# Altium project IPG.PrjPcb (part 6 of 13)

## Sheet 07-PowerManagement.SchDoc: Power Management
size A2; DocumentNumber: 7; SheetNumber: 7; SheetTotal: 15
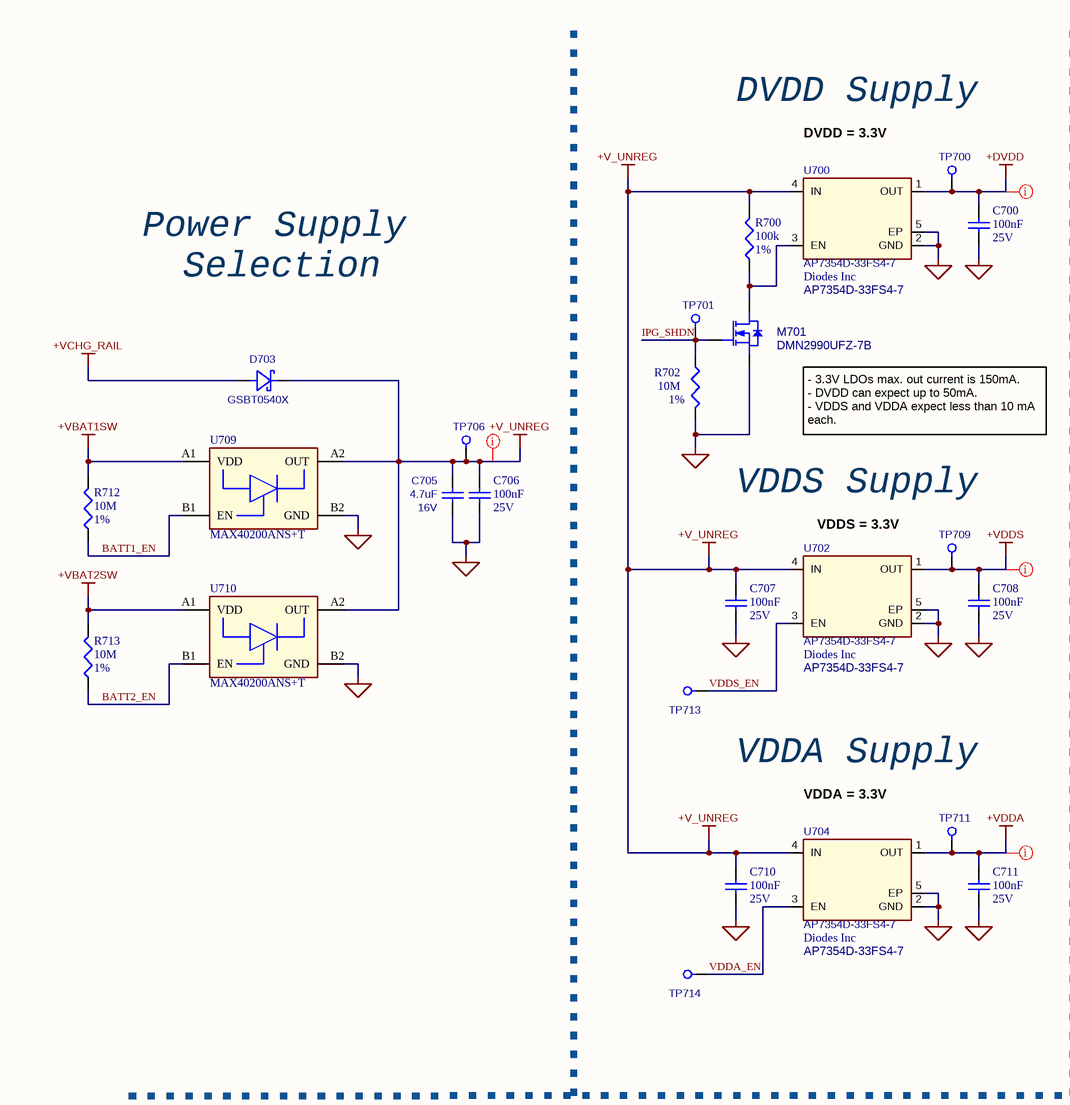
[diagram p19: 07-PowerManagement.SchDoc, left]
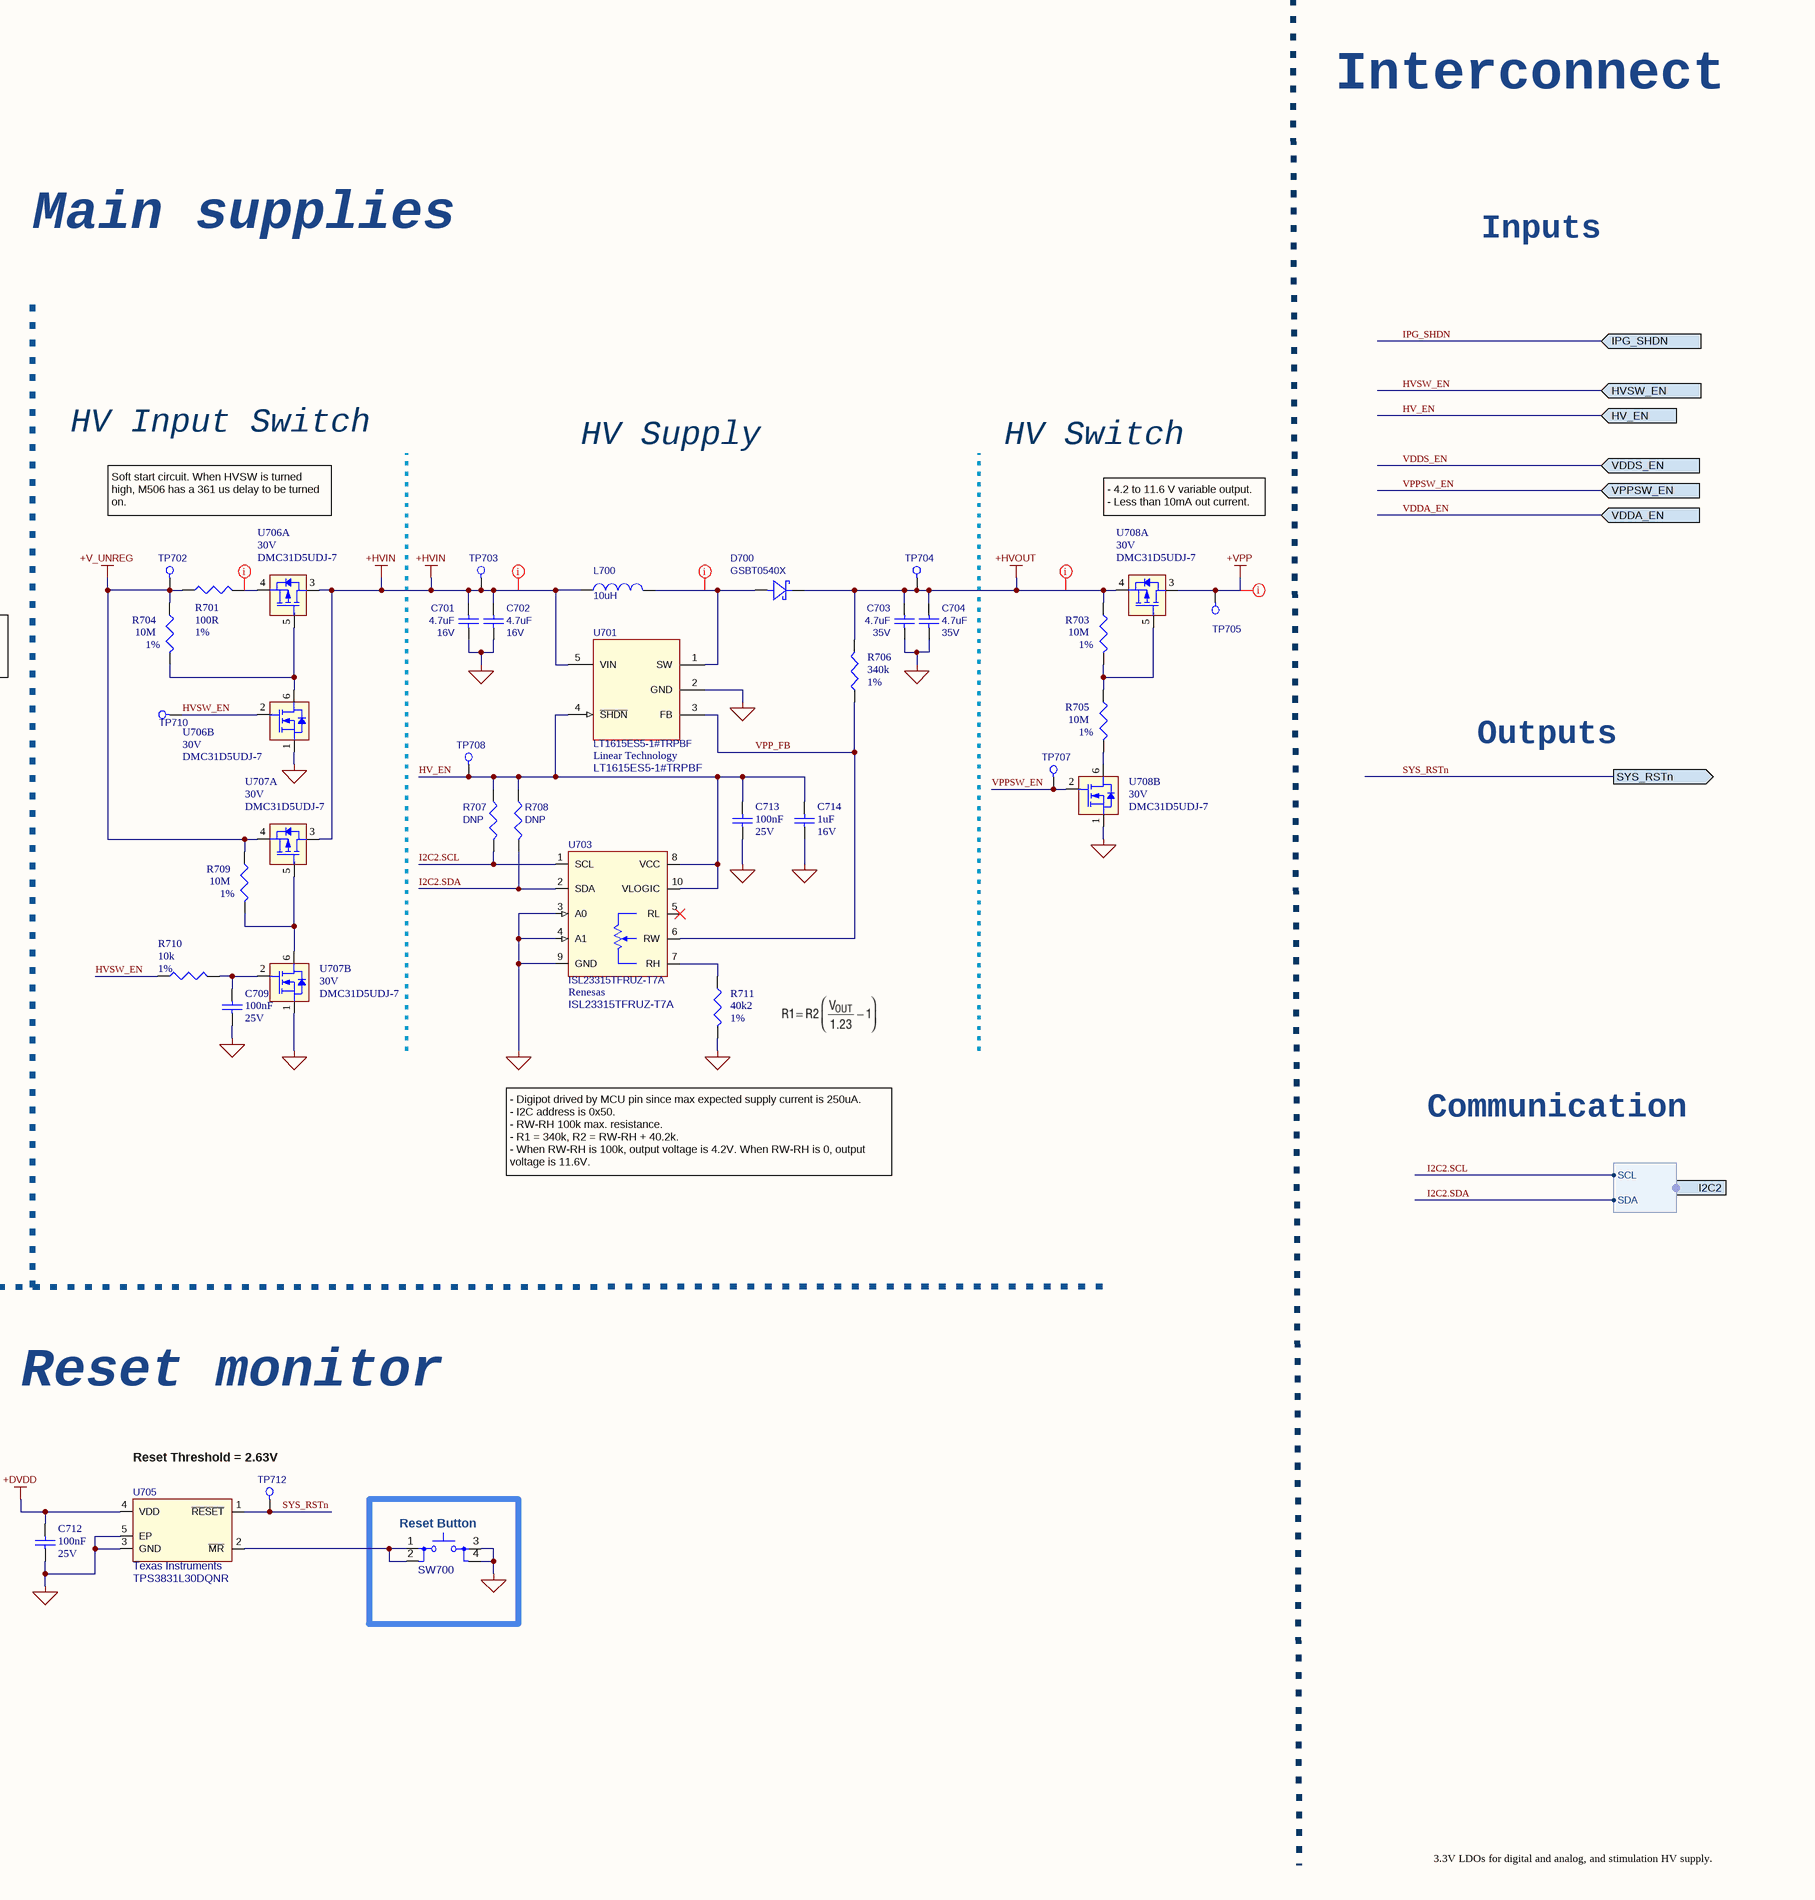
[diagram p20: 07-PowerManagement.SchDoc, right]

### Parts
C700  value 100nF  Rated DC Voltage (URdc): 25V  [C0201_C]  (hidden comment: GRM033R61E104KE14J)
C701  value 4.7uF  Rating: 16V  [CAP0603_REDUCED]  (hidden comment: GRM188R61C475KE11)
C702  value 4.7uF  Rating: 16V  [CAP0603_REDUCED]  (hidden comment: GRM188R61C475KE11)
C703  value 4.7uF  Rating: 35V  [CAP0805_REDUCED]  (hidden comment: GCM21BC7YA475KE36L)
C704  value 4.7uF  Rating: 35V  [CAP0805_REDUCED]  (hidden comment: GCM21BC7YA475KE36L)
C705  value 4.7uF  Rating: 16V  [CAP0603_REDUCED]  (hidden comment: GRM188R61C475KE11)
C706  value 100nF  Rated DC Voltage (URdc): 25V  [C0201_C]  (hidden comment: GRM033R61E104KE14J)
C707  value 100nF  Rated DC Voltage (URdc): 25V  [C0201_C]  (hidden comment: GRM033R61E104KE14J)
C708  value 100nF  Rated DC Voltage (URdc): 25V  [C0201_C]  (hidden comment: GRM033R61E104KE14J)
C709  value 100nF  Rated DC Voltage (URdc): 25V  [C0201_C]  (hidden comment: GRM033R61E104KE14J)
C710  value 100nF  Rated DC Voltage (URdc): 25V  [C0201_C]  (hidden comment: GRM033R61E104KE14J)
C711  value 100nF  Rated DC Voltage (URdc): 25V  [C0201_C]  (hidden comment: GRM033R61E104KE14J)
C712  value 100nF  Rated DC Voltage (URdc): 25V  [C0201_C]  (hidden comment: GRM033R61E104KE14J)
C713  value 100nF  Rated DC Voltage (URdc): 25V  [C0201_C]  (hidden comment: GRM033R61E104KE14J)
C714  value 1uF  Rated DC Voltage (URdc): 16V  [C0201_C]  (hidden comment: GRM033R61C105ME15D)
D700  GSBT0540X  [STM_SOD-523_R]
D703  GSBT0540X  [STM_SOD-523_R]
L700  value 10uH  [WURTH_74438323100_REDUCED]  (hidden comment: 74438323100)
M701  DMN2990UFZ-7B  [DIODESINC_X2-DFN0606-3]
R700  value 100k  Tolerance: 1%  [R0201_C]  (hidden comment: CRCW0201100KFNED)
R701  value 100R  Tolerance: 1%  [R0201_C]  (hidden comment: CRCW0201100RFNED)
R702  value 10M  Tolerance: 1%  [R0201_C]  (hidden comment: CRCW020110M0FNED)
R703  value 10M  Tolerance: 1%  [R0201_C]  (hidden comment: CRCW020110M0FNED)
R704  value 10M  Tolerance: 1%  [R0201_C]  (hidden comment: CRCW020110M0FNED)
R705  value 10M  Tolerance: 1%  [R0201_C]  (hidden comment: CRCW020110M0FNED)
R706  value 340k  Tolerance: 1%  [R0201_C]  (hidden comment: CRCW0201340KFKED)
R707  value DNP  [RES0402_REDUCED]  (hidden comment: Resistor, DNP, 0402)
R708  value DNP  [RES0402_REDUCED]  (hidden comment: Resistor, DNP, 0402)
R709  value 10M  Tolerance: 1%  [R0201_C]  (hidden comment: CRCW020110M0FNED)
R710  value 10k  Tolerance: 1%  [R0201_C]  (hidden comment: CRCW020110K0FNED)
R711  value 40k2  Tolerance: 1%  [R0201_C]  (hidden comment: CRCW020140K2FNED)
R712  value 10M  Tolerance: 1%  [R0201_C]  (hidden comment: CRCW020110M0FNED)
R713  value 10M  Tolerance: 1%  [R0201_C]  (hidden comment: CRCW020110M0FNED)
SW700  PTS647SN50SMTR2LFS  [CK_PTS647]  (value not drawn)
TP700  Test Point  [testpad_0.9mm]  (value not drawn)  (no BOM)
TP701  Test Point  [testpad_0.9mm]  (value not drawn)  (no BOM)
TP702  Test Point  [testpad_0.9mm]  (value not drawn)  (no BOM)
TP703  Test Point  [testpad_0.9mm]  (value not drawn)  (no BOM)
TP704  Test Point  [testpad_0.9mm]  (value not drawn)  (no BOM)
TP705  Test Point  [testpad_0.9mm]  (value not drawn)  (no BOM)
TP706  Test Point  [testpad_0.9mm]  (value not drawn)  (no BOM)
TP707  Test Point  [testpad_0.9mm]  (value not drawn)  (no BOM)
TP708  Test Point  [testpad_0.9mm]  (value not drawn)  (no BOM)
TP709  Test Point  [testpad_0.9mm]  (value not drawn)  (no BOM)
TP710  Test Point  [testpad_0.9mm]  (value not drawn)  (no BOM)
TP711  Test Point  [testpad_0.9mm]  (value not drawn)  (no BOM)
TP712  Test Point  [testpad_0.9mm]  (value not drawn)  (no BOM)
TP713  Test Point  [testpad_0.9mm]  (value not drawn)  (no BOM)
TP714  Test Point  [testpad_0.9mm]  (value not drawn)  (no BOM)
U700  AP7354D-33FS4-7  Manufacturer: Diodes Inc  [X2-DFN1010-4 (Type B)]
U701  LT1615ES5-1#TRPBF  Manufacturer: Linear Technology  [LT_S5_L]
U702  AP7354D-33FS4-7  Manufacturer: Diodes Inc  [X2-DFN1010-4 (Type B)]
U703  ISL23315TFRUZ-T7A  Manufacturer: Renesas  [RENESAS_L10.2.1X1.6A_UTQFN10]
U704  AP7354D-33FS4-7  Manufacturer: Diodes Inc  [X2-DFN1010-4 (Type B)]
U705  Manufacturer: Texas Instruments  [TI_X2SON_DQN0004A]  (hidden comment: TPS3831L30DQNR)
U706  DMC31D5UDJ-7  Vds(Max): 30V  [DIODESINC_SOT-963-6]  (parts A,B of 2)
U707  DMC31D5UDJ-7  Vds(Max): 30V  [DIODESINC_SOT-963-6]  (parts A,B of 2)
U708  DMC31D5UDJ-7  Vds(Max): 30V  [DIODESINC_SOT-963-6]  (parts A,B of 2)
U709  MAX40200ANS+T  [BGA4N35P2X2_72X72X50N]
U710  MAX40200ANS+T  [BGA4N35P2X2_72X72X50N]

### Ports
HV_EN (in), HVSW_EN (in), I2C2 (harness I2C), IPG_SHDN (in), SYS_RSTn (out), VDDA_EN (in), VDDS_EN (in), VPPSW_EN (in)

### Harnesses
I2C: SDA, SCL

### Nets
+DVDD: C700.2 C712.2 TP700.1 U700.1(OUT) U705.4(VDD)
+HVIN: C701.1 C702.1 L700.1 TP703.1 U701.5(VIN) U706.3 U707.3
+HVOUT: C703.1 C704.1 D700.1 R703.1 R706.2 TP704.1 U708.4
+V_UNREG: C705.1 C706.2 C707.2 C710.2 D703.1 R700.2 R701.1 R704.1 R709.1 TP702.1 TP706.1 U700.4(IN) U702.4(IN) U704.4(IN) U707.4 U709.A2(OUT) U710.A2(OUT)
+VBAT1SW: R712.2 U709.A1(VDD)
+VBAT2SW: R713.2 U710.A1(VDD)
+VCHG_RAIL: D703.2
+VDDA: C711.2 TP711.1 U704.1(OUT)
+VDDS: C708.2 TP709.1 U702.1(OUT)
+VPP: TP705.1 U708.3
GND: C700.1 C701.2 C702.2 C703.2 C704.2 C705.2 C706.1 C707.1 C708.1 C709.1 C710.1 C711.1 C712.1 C713.1 C714.1 M701.2(S) R702.2 R711.2 SW700.3 SW700.4 U700.2(GND) U700.5(EP) U701.2(GND) U702.2(GND) U702.5(EP) U703.3(A0) U703.4(A1) U703.9(GND) U704.2(GND) U704.5(EP) U705.3(GND) U705.5(EP) U706.1 U707.1 U708.1 U709.B2(GND) U710.B2(GND)
BATT1_EN: R712.1 U709.B1(EN)
BATT2_EN: R713.1 U710.B1(EN)
HV_EN: C713.2 C714.2 R707.1 R708.1 TP708.1 U701.4(~{SHDN}) U703.8(VCC) U703.10(VLOGIC) ; port HV_EN
HVSW_EN: R710.1 TP710.1 U706.2 ; port HVSW_EN
I2C2.SCL: R707.2 U703.1(SCL) ; port I2C2.SCL
I2C2.SDA: R708.2 U703.2(SDA) ; port I2C2.SDA
IPG_SHDN: M701.1(G) R702.1 TP701.1 ; port IPG_SHDN
SYS_RSTn: TP712.1 U705.1(~{RESET}) ; port SYS_RSTn
VDDA_EN: TP714.1 U704.3(EN) ; port VDDA_EN
VDDS_EN: TP713.1 U702.3(EN) ; port VDDS_EN
VPP_FB: R706.1 U701.3(FB) U703.6(RW)
VPPSW_EN: TP707.1 U708.2 ; port VPPSW_EN
NetC709_2: C709.2 R710.2 U707.2
NetD700_2: D700.2 L700.2 U701.1(SW)
NetM701_3: M701.3(D) R700.1 U700.3(EN)
NetR701_2: R701.2 U706.4
NetR703_2: R703.2 R705.1 U708.5
NetR704_2: R704.2 U706.5 U706.6
NetR705_2: R705.2 U708.6
NetR709_2: R709.2 U707.5 U707.6
NetR711_1: R711.1 U703.7(RH)
NetSW700_1: SW700.1 SW700.2 U705.2(~{MR})

Not connected (* = marked no-connect by the designer): U703 5(RL)*

### Layout directives
rule Supply Nets [Voltage = 3.300]; net class POWER: +DVDD, +VDDA, +VDDS
Voltage: 4.2-11.6V; net class POWER: +VPP
net class POWER; Voltage: 2.8-5.0V; net class DCDC_LOOP: +HVIN
net class POWER; Voltage: 4.2-11.6V: +HVOUT
net class POWER; Voltage: 2.8-5.0V: +V_UNREG, NetR701_2
net class POWER; Voltage: 4.2-11.6V; net class DCDC_LOOP: NetD700_2

### Notes on the sheet
- Interconnect
- Main supplies
- Inputs
- DVDD Supply
- DVDD = 3.3V
- HV Input Switch
- Power Supply
- HV Supply
- HV Switch
- Selection
- Soft start circuit. When HVSW is turned high, M506 has a 361 us delay to be turned on.
- - 4.2 to 11.6 V variable output.
  - Less than 10mA out current.
- - 3.3V LDOs max. out current is 150mA.
  - DVDD can expect up to 50mA.
  - VDDS and VDDA expect less than 10 mA each.
- VDDS Supply
- Outputs
- VDDS = 3.3V
- VDDA Supply
- VDDA = 3.3V
- Communication
- - Digipot drived by MCU pin since max expected supply current is 250uA.
  - I2C address is 0x50.
  - RW-RH 100k max. resistance.
  - R1 = 340k, R2 = RW-RH + 40.2k.
  - When RW-RH is 100k, output voltage is 4.2V. When RW-RH is 0, output voltage is 11.6V.
- Reset monitor
- Reset Threshold = 2.63V
- (near SW700) Reset Button
- 3.3V LDOs for digital and analog, and stimulation HV supply.
- Project:
- Schematic:
- Design by:
- Date:
- Ver:
- .
- Comments:
- Reviewed by:

### Library data of the parts
C700 C706-C713 = GRM033R61E104KE14J: as C900-C906 on sheet 09-IMC; Category: Ceramic Capacitors; Supplier: Digikey; Supplier Part Number: 490-14571-1-ND; Manufacturer Part Number: GRM033R61E104KE14J; RoHS: Yes; Stock: 1540851; Pricing: 1=0,1, 10=0,033, 50=0,0192, 100=0,0148, 500=0,01118, 1000=0,00878, 2500=0,00798, 5000=0,00734 (USD); Mounting Technology: Surface Mount; Pins: 2; Dielectric Material: Ceramic; Package Shape: Rectangular; Case/Package: 0201; Terminal Finish: Nickel; Min Operating Temperature: -55°C; Max Operating Temperature: 85°C; JESD-609 Code: e3; Capacitor Type: Ceramic; Tolerance  (fill in as +-): 10%; Package Style: SMTMeter; Packaging: Tape and Reel; Tolerance (fill in as +-): 10%; Temperature Characteristics Code: X5R; Termination: Wraparound; Length: 0.6mm; Width: 0.3mm; Height: 0.3mm; Reach SVHC Compliant: Yes; RoHS Compliant: Yes; ComponentLink1URL: https://psearch.en.murata.com:443/capacitor/product/GRM033R61E104KE14%23.pdf?src-supplier=IHS+Markit; ComponentLink1Description: https://psearch.en.murata.com:443/capacitor/product/GRM033R61E104KE14%23.pdf?src-supplier=IHS+Markit; ComponentLink2URL: http://www.mouser.com/ds/2/281/c02e-2905.pdf?src-supplier=Mouser; ComponentLink2Description: http://www.mouser.com/ds/2/281/c02e-2905.pdf?src-supplier=Mouser; ComponentLink3URL: http://search.murata.co.jp/Ceramy/image/img/A01X/G101/ENG/GRM033R61E104KE14-01.pdf?src-supplier=Digikey; ComponentLink3Description: http://search.murata.co.jp/Ceramy/image/img/A01X/G101/ENG/GRM033R61E104KE14-01.pdf?src-supplier=Digikey; ComponentLink4URL: https://search.murata.co.jp/Ceramy/image/img/A01X/G101/ENG/GRM033R61E104KE14-01.pdf?src-supplier=Digikey; ComponentLink4Description: https://search.murata.co.jp/Ceramy/image/img/A01X/G101/ENG/GRM033R61E104KE14-01.pdf?src-supplier=Digikey; Supplier 1: Arrow Electronics; Supplier Part Number 1: GRM033R61E104KE14J
C701 C702 C705 = GRM188R61C475KE11: as C302 on sheet 03-MCU; Length (mm): 1.60 ±0.10; Medical Grade MFR: Murata; PCB Footprint: cap0603_reduced; Thickness (mm): 0.80 ±0.10; Width (mm): 0.80 ±0.10; Category: Capacitor; Package Description: 0603; Check: *; Supplier 1: Arrow Electronics; Supplier Part Number 1: GRM188R61C475KE11D; Status: *; Review: *; Manufacturer Part Number: GRM188R61C475KE11
C703 C704 = GCM21BC7YA475KE36L: Capacitor, 4.7uF, X7S, 35V, 10%, 0805, Implant-grade; Manufacturer: Murata; Medical Grade MFR PN: GCH21BC7YA475KE11; Review: 020823; Length (mm): 2.00 ±0.20; Medical Grade MFR: Murata; PCB Footprint: cap0805_reduced; Thickness (mm): 1.25 ±0.20; Width (mm): 1.25 ±0.20; Category: Capacitor; Package Description: 0805; Check: *; Supplier 1: Arrow Electronics; Supplier Part Number 1: GCM21BC7YA475KE36L; Status: Approved; Manufacturer Part Number: GCM21BC7YA475KE36L
C714 = GRM033R61C105ME15D: as C317 on sheet 03-MCU; Supplier: Digikey; Supplier Part Number: 490-18654-1-ND; Manufacturer Part Number: GRM033R61C105ME15D; RoHS: No; Category: Ceramic Capacitors; Stock: 132893; Pricing: 1=0,16, 10=0,105, 50=0,0628, 100=0,0493, 500=0,03644, 1000=0,03017, 2500=0,02808, 5000=0,02569 (USD); Supplier 1: Avnet; Supplier Part Number 1: GRM033R61C105ME15D
D700 D703 = GSBT0540X: DIODE SCHOTTKY 40V 500MA SOD523; Manufacturer: Good-Ark Semiconductor; Medical Grade MFR: TBD; Rating: 40V, 500mA; Medical Grade MFR PN: TBD; PCB Footprint: TBD; Category: Diode; Package Description: SOD-523; Supplier 1: Digikey; Supplier Part Number 1: 4786-GSBT0540XCT-ND; Manufacturer Part Number: GSBT0540X
L700 = 74438323100: Inductor, 10uH, 600mA, 20%, 1008; Manufacturer: Wurth; Medical Grade MFR: TBD; Review: 020823; Length (mm): 2.50 ±0.20; Medical Grade MFR PN: TBD; PCB Footprint: TBD; Rating: 600mA; Thickness (mm): 1.00; Width (mm): 2.00 ±0.20; Category: Inductor; Supplier 1: Rs; Supplier Part Number 1: 7922736P; Status: Approved; Manufacturer Part Number: 74438323100
M701 = DMN2990UFZ-7B: MOSFET, N-Chan, 20V, 170mA, DFN0606; Manufacturer: Diodes Inc; Medical Grade MFR: TBD; Review: 020823; Category: Transistor; Length (mm): 0.62 ±0.05; Medical Grade MFR PN: TBD; PCB Footprint: TBD; Rating: 20V; Thickness (mm): 0.38 ±0.02; Value: DMN2990UFZ-7B; Width (mm): 0.62 ±0.05; Supplier 1: Digi-Key; Supplier Part Number 1: DMN2990UFZ-7BDICT-ND; Status: Approved; Manufacturer Part Number: DMN2990UFZ-7B
R700 = CRCW0201100KFNED: as R914 on sheet 09-IMC; Category: Chip SMD Resistors; Supplier: Digikey; Supplier Part Number: 541-100KABCT-ND; Manufacturer Part Number: CRCW0201100KFNED; RoHS: Yes; Stock: 8252; Pricing: 1=0,1, 10=0,037, 50=0,0242, 100=0,0204, 500=0,01426, 1000=0,01241, 5000=0,00924 (USD); Mounting Technology: Surface Mount; Pins: 2; Package Shape: Rectangular; Case/Package: 0201; Terminal Finish: Nickel; Min Operating Temperature: -55°C; Max Operating Temperature: 155°C; JESD-609 Code: e3; Resistor Type: FIXED RESISTOR; Construction: Chip; Package Style: SMTMeter; Packaging: Tape and Reel; Technology: METAL GLAZE/THICK FILM; Termination: Wraparound; Working Voltage: 30V; Reach SVHC Compliant: Yes; RoHS Compliant: Yes; ComponentLink1URL: https://datasheet.ciiva.com:443/pdfs/VipMasterIC/IC/VISH/VISH-S-A0002932828/VISH-S-A0002932828-1.pdf?src-supplier=IHS+Markit; ComponentLink1Description: https://datasheet.ciiva.com:443/pdfs/VipMasterIC/IC/VISH/VISH-S-A0002932828/VISH-S-A0002932828-1.pdf?src-supplier=IHS+Markit; ComponentLink2URL: https://datasheet.ciiva.com/2474/crcw0201e3-2474797.pdf?src-supplier=Digikey; ComponentLink2Description: https://datasheet.ciiva.com/2474/crcw0201e3-2474797.pdf?src-supplier=Digikey; ComponentLink3URL: https://datasheet.ciiva.com/2474/crcw0201e3-2474798.pdf?src-supplier=Digikey; ComponentLink3Description: https://datasheet.ciiva.com/2474/crcw0201e3-2474798.pdf?src-supplier=Digikey; ComponentLink4URL: https://datasheet.ciiva.com/2474/crcw0201e3-2474799.pdf?src-supplier=Digikey; ComponentLink4Description: https://datasheet.ciiva.com/2474/crcw0201e3-2474799.pdf?src-supplier=Digikey; ComponentLink5URL: https://datasheet.ciiva.com/16436/dcrcwe3-16436220.pdf?src-supplier=Future+Electronics; ComponentLink5Description: https://datasheet.ciiva.com/16436/dcrcwe3-16436220.pdf?src-supplier=Future+Electronics; ComponentLink6URL: https://datasheet.ciiva.com/28634/1847332-28634462.pdf?src-supplier=Element14; ComponentLink6Description: https://datasheet.ciiva.com/28634/1847332-28634462.pdf?src-supplier=Element14; ComponentLink7URL: https://datasheet.ciiva.com/22665/1700795-22665689.pdf?src-supplier=Element14; ComponentLink7Description: https://datasheet.ciiva.com/22665/1700795-22665689.pdf?src-supplier=Element14; ComponentLink8URL: https://datasheet.ciiva.com/22870/70202042-22870476.pdf?src-supplier=Allied+Electronics; ComponentLink8Description: https://datasheet.ciiva.com/22870/70202042-22870476.pdf?src-supplier=Allied+Electronics; ComponentLink9URL: https://datasheet.ciiva.com/16777/70202042-16777655.pdf?src-supplier=Allied+Electronics; ComponentLink9Description: https://datasheet.ciiva.com/16777/70202042-16777655.pdf?src-supplier=Allied+Electronics; Supplier 1: Digikey; Supplier Part Number 1: 541-100KABCT-ND
R701 = CRCW0201100RFNED: Fixed Resistor, Metal Glaze/thick Film, 0.05W, 100ohm, 30V, 1% +/-Tol, 200ppm/Cel, Surface Mount, 0201; Manufacturer: Vishay; Medical Grade MFR: Mini-Systems; Medical Grade MFR PN: MWA96SM-1000F-NS62TR; Power: 50mW; Rated Temperature: 70°C; Temperature Coefficient: 200ppm/°C; Package Height: 0.23mm; Package Length: 0.6mm; Package Width: 0.3mm; Reference Standard: AEC-Q200; Category: Chip SMD Resistors; Supplier: Digikey; Supplier Part Number: 541-100ABCT-ND; Manufacturer Part Number: CRCW0201100RFNED; RoHS: Yes; Stock: 52904; Pricing: 1=0,1, 10=0,037, 50=0,0242, 100=0,0204, 500=0,01426, 1000=0,01241, 5000=0,00924 (USD); Mounting Technology: Surface Mount; Pins: 2; Package Shape: Rectangular; Terminal Finish: Nickel; Case/Package: 0201; Min Operating Temperature: -55°C; Max Operating Temperature: 155°C; JESD-609 Code: e3; Package Style: SMTMeter; Technology: METAL GLAZE/THICK FILM; Resistor Type: FIXED RESISTOR; Construction: Chip; Packaging: Tape and Reel; Termination: Wraparound; Working Voltage: 30V; Reach SVHC Compliant: Yes; RoHS Compliant: Yes; ComponentLink1URL: https://datasheet.ciiva.com:443/pdfs/VipMasterIC/IC/VISH/VISH-S-A0002932828/VISH-S-A0002932828-1.pdf?src-supplier=IHS+Markit; ComponentLink1Description: https://datasheet.ciiva.com:443/pdfs/VipMasterIC/IC/VISH/VISH-S-A0002932828/VISH-S-A0002932828-1.pdf?src-supplier=IHS+Markit; ComponentLink2URL: https://datasheet.ciiva.com/8083/crcw0201e3-8083961.pdf?src-supplier=Avnet; ComponentLink2Description: https://datasheet.ciiva.com/8083/crcw0201e3-8083961.pdf?src-supplier=Avnet; ComponentLink3URL: https://datasheet.ciiva.com/2527/crcw0201e3-2527593.pdf?src-supplier=Digikey; ComponentLink3Description: https://datasheet.ciiva.com/2527/crcw0201e3-2527593.pdf?src-supplier=Digikey; ComponentLink4URL: https://datasheet.ciiva.com/2527/crcw0201e3-2527591.pdf?src-supplier=Digikey; ComponentLink4Description: https://datasheet.ciiva.com/2527/crcw0201e3-2527591.pdf?src-supplier=Digikey; ComponentLink5URL: https://datasheet.ciiva.com/2527/crcw0201e3-2527592.pdf?src-supplier=Digikey; ComponentLink5Description: https://datasheet.ciiva.com/2527/crcw0201e3-2527592.pdf?src-supplier=Digikey; ComponentLink6URL: https://datasheet.ciiva.com/7983/1719906-7983317.pdf?src-supplier=Element14; ComponentLink6Description: https://datasheet.ciiva.com/7983/1719906-7983317.pdf?src-supplier=Element14; ComponentLink7URL: https://datasheet.ciiva.com/7983/1719906-7983318.pdf?src-supplier=Element14; ComponentLink7Description: https://datasheet.ciiva.com/7983/1719906-7983318.pdf?src-supplier=Element14; ComponentLink8URL: https://datasheet.ciiva.com/16757/70202042-16757607.pdf?src-supplier=Allied+Electronics; ComponentLink8Description: https://datasheet.ciiva.com/16757/70202042-16757607.pdf?src-supplier=Allied+Electronics; ComponentLink9URL: https://datasheet.ciiva.com/16202/dcrcwe3-16202605.pdf?src-supplier=Future+Electronics; ComponentLink9Description: https://datasheet.ciiva.com/16202/dcrcwe3-16202605.pdf?src-supplier=Future+Electronics; ComponentLink10URL: https://datasheet.ciiva.com/22665/1700795-22665690.pdf?src-supplier=Element14; ComponentLink10Description: https://datasheet.ciiva.com/22665/1700795-22665690.pdf?src-supplier=Element14; Supplier 1: Digikey; Supplier Part Number 1: 541-100ABCT-ND
R702-R705 R709 R712 R713 = CRCW020110M0FNED: as R903 on sheet 09-IMC; Category: Chip SMD Resistors; Supplier: Mouser; Supplier Part Number: 71-CRCW020110M0FNED; Manufacturer Part Number: CRCW020110M0FNED; RoHS: Yes; Stock: 159754; Pricing: 1=0,1, 10=0,024, 50=0,024, 100=0,014, 1000=0,011, 10000=0,006 (USD); Mounting Technology: Surface Mount; Pins: 2; Package Shape: Rectangular; Case/Package: 0201; Terminal Finish: Nickel; Min Operating Temperature: -55°C; Max Operating Temperature: 155°C; JESD-609 Code: e3; Resistor Type: FIXED RESISTOR; Packaging: Tape and Reel; Technology: METAL GLAZE/THICK FILM; Termination: Wraparound; Working Voltage: 30V; Reach SVHC Compliant: Yes; RoHS Compliant: Yes; ComponentLink1URL: https://datasheet.ciiva.com:443/pdfs/VipMasterIC/IC/VISH/VISH-S-A0002932828/VISH-S-A0002932828-1.pdf?src-supplier=IHS+Markit; ComponentLink1Description: https://datasheet.ciiva.com:443/pdfs/VipMasterIC/IC/VISH/VISH-S-A0002932828/VISH-S-A0002932828-1.pdf?src-supplier=IHS+Markit; ComponentLink2URL: https://datasheet.ciiva.com/7673/1719906-7673177.pdf?src-supplier=Element14; ComponentLink2Description: https://datasheet.ciiva.com/7673/1719906-7673177.pdf?src-supplier=Element14; ComponentLink3URL: https://datasheet.ciiva.com/7673/1719906-7673178.pdf?src-supplier=Element14; ComponentLink3Description: https://datasheet.ciiva.com/7673/1719906-7673178.pdf?src-supplier=Element14; ComponentLink4URL: https://datasheet.ciiva.com/22692/1719906-22692711.pdf?src-supplier=Element14; ComponentLink4Description: https://datasheet.ciiva.com/22692/1719906-22692711.pdf?src-supplier=Element14; ComponentLink5URL: https://datasheet.ciiva.com/22665/1700795-22665701.pdf?src-supplier=Element14; ComponentLink5Description: https://datasheet.ciiva.com/22665/1700795-22665701.pdf?src-supplier=Element14; Supplier 1: Digikey; Supplier Part Number 1: 541-CRCW020110M0FNEDCT-ND
R706 = CRCW0201340KFKED: Fixed Resistor, Metal Glaze/thick Film, 0.05W, 340000ohm, 30V, 1% +/-Tol, 200ppm/Cel, Surface Mount, 0201; Manufacturer: Vishay; Medical Grade MFR: Mini-Systems; Medical Grade MFR PN: MWA96SM-3403F-NS62TR; Power: 50mW; Rated Temperature: 70°C; Temperature Coefficient: 200ppm/°C; Package Height: 0.23mm; Package Length: 0.6mm; Package Width: 0.3mm; Reference Standard: AEC-Q200; Supplier: Digikey; Supplier Part Number: 541-340KAABDKR-ND; Manufacturer Part Number: CRCW0201340KFKED; RoHS: Yes; Category: Chip SMD Resistors; Pricing: 1=0,1, 10=0,037, 50=0,0242, 100=0,0204, 500=0,01426, 1000=0,01241, 5000=0,00924 (USD); Mounting Technology: Surface Mount; Pins: 2; Package Shape: Rectangular; Case/Package: 0201; Terminal Finish: Nickel; Min Operating Temperature: -55°C; Max Operating Temperature: 155°C; JESD-609 Code: e3; Resistor Type: FIXED RESISTOR; Construction: Chip; Package Style: SMTMeter; Packaging: Tape and Reel; Technology: METAL GLAZE/THICK FILM; Termination: Wraparound; Working Voltage: 30V; Reach SVHC Compliant: Yes; RoHS Compliant: Yes; ComponentLink1URL: https://datasheet.ciiva.com:443/pdfs/VipMasterIC/IC/VISH/VISH-S-A0002932828/VISH-S-A0002932828-1.pdf?src-supplier=IHS+Markit; ComponentLink1Description: https://datasheet.ciiva.com:443/pdfs/VipMasterIC/IC/VISH/VISH-S-A0002932828/VISH-S-A0002932828-1.pdf?src-supplier=IHS+Markit; ComponentLink2URL: https://datasheet.ciiva.com/2577/crcw0201e3-2577344.pdf?src-supplier=Digikey; ComponentLink2Description: https://datasheet.ciiva.com/2577/crcw0201e3-2577344.pdf?src-supplier=Digikey; ComponentLink3URL: https://datasheet.ciiva.com/8944/crcw0201e3-8944076.pdf?src-supplier=Avnet; ComponentLink3Description: https://datasheet.ciiva.com/8944/crcw0201e3-8944076.pdf?src-supplier=Avnet; ComponentLink4URL: https://datasheet.ciiva.com/7673/1719906-7673960.pdf?src-supplier=Element14; ComponentLink4Description: https://datasheet.ciiva.com/7673/1719906-7673960.pdf?src-supplier=Element14; ComponentLink5URL: https://datasheet.ciiva.com/7673/1719906-7673961.pdf?src-supplier=Element14; ComponentLink5Description: https://datasheet.ciiva.com/7673/1719906-7673961.pdf?src-supplier=Element14; ComponentLink6URL: https://datasheet.ciiva.com/22706/1719906-22706187.pdf?src-supplier=Element14; ComponentLink6Description: https://datasheet.ciiva.com/22706/1719906-22706187.pdf?src-supplier=Element14; ComponentLink7URL: https://datasheet.ciiva.com/22675/1700795-22675861.pdf?src-supplier=Element14; ComponentLink7Description: https://datasheet.ciiva.com/22675/1700795-22675861.pdf?src-supplier=Element14; Supplier 1: Digikey; Supplier Part Number 1: 541-340KAABCT-ND
R707 R708 = RES_DNP_0402: Review: 020823; Length (mm): 1.12 ±0.10; Manufacturer: N/A; Manufacturer PN: N/A; Medical Grade MFR: N/A; Medical Grade MFR PN: N/A; PCB Footprint: res0402_reduced; Rating: N/A; Thickness (mm): 0.33 ±0.08; Width (mm): 0.56 ±0.08; Category: Resistor; Status: Approved
R710 = CRCW020110K0FNED: as R300 on sheet 03-MCU; Category: Chip SMD Resistors; Supplier: Digikey; Supplier Part Number: 541-10.0KABCT-ND; Manufacturer Part Number: CRCW020110K0FNED; RoHS: Yes; Stock: 1011530; Pricing: 1=0,1, 10=0,037, 50=0,0242, 100=0,0204, 500=0,01426, 1000=0,01241, 5000=0,00924 (USD); Mounting Technology: Surface Mount; Pins: 2; Package Shape: Rectangular; Case/Package: 0201; Terminal Finish: Nickel; Min Operating Temperature: -55°C; Max Operating Temperature: 155°C; JESD-609 Code: e3; Resistor Type: FIXED RESISTOR; Construction: Chip; Package Style: SMTMeter; Packaging: Tape and Reel; Technology: METAL GLAZE/THICK FILM; Termination: Wraparound; Working Voltage: 30V; Reach SVHC Compliant: Yes; RoHS Compliant: Yes; ComponentLink1URL: https://datasheet.ciiva.com:443/pdfs/VipMasterIC/IC/VISH/VISH-S-A0002932828/VISH-S-A0002932828-1.pdf?src-supplier=IHS+Markit; ComponentLink1Description: https://datasheet.ciiva.com:443/pdfs/VipMasterIC/IC/VISH/VISH-S-A0002932828/VISH-S-A0002932828-1.pdf?src-supplier=IHS+Markit; ComponentLink2URL: https://datasheet.ciiva.com/2474/crcw0201e3-2474819.pdf?src-supplier=Digikey; ComponentLink2Description: https://datasheet.ciiva.com/2474/crcw0201e3-2474819.pdf?src-supplier=Digikey; ComponentLink3URL: https://datasheet.ciiva.com/2474/crcw0201e3-2474820.pdf?src-supplier=Digikey; ComponentLink3Description: https://datasheet.ciiva.com/2474/crcw0201e3-2474820.pdf?src-supplier=Digikey; ComponentLink4URL: https://datasheet.ciiva.com/2474/crcw0201e3-2474818.pdf?src-supplier=Digikey; ComponentLink4Description: https://datasheet.ciiva.com/2474/crcw0201e3-2474818.pdf?src-supplier=Digikey; ComponentLink5URL: https://datasheet.ciiva.com/16436/dcrcwe3-16436222.pdf?src-supplier=Future+Electronics; ComponentLink5Description: https://datasheet.ciiva.com/16436/dcrcwe3-16436222.pdf?src-supplier=Future+Electronics; ComponentLink6URL: https://datasheet.ciiva.com/7983/1719906-7983320.pdf?src-supplier=Element14; ComponentLink6Description: https://datasheet.ciiva.com/7983/1719906-7983320.pdf?src-supplier=Element14; ComponentLink7URL: https://datasheet.ciiva.com/7983/1719906-7983319.pdf?src-supplier=Element14; ComponentLink7Description: https://datasheet.ciiva.com/7983/1719906-7983319.pdf?src-supplier=Element14; ComponentLink8URL: https://datasheet.ciiva.com/22692/1719906-22692709.pdf?src-supplier=Element14; ComponentLink8Description: https://datasheet.ciiva.com/22692/1719906-22692709.pdf?src-supplier=Element14; Supplier 1: Mouser; Supplier Part Number 1: 71-CRCW0201-10K
R711 = CRCW020140K2FNED: Fixed Resistor, Metal Glaze/thick Film, 0.05W, 40200ohm, 30V, 1% +/-Tol, 200ppm/Cel, Surface Mount, 0201; Manufacturer: Vishay; Medical Grade MFR: Mini-Systems; Medical Grade MFR PN: MWA96SM-4022F-NS62TR; Power: 50mW; Rated Temperature: 70°C; Temperature Coefficient: 200ppm/°C; Package Height: 0.23mm; Package Length: 0.6mm; Package Width: 0.3mm; Reference Standard: AEC-Q200; Category: Chip SMD Resistors; Supplier: Digikey; Supplier Part Number: 541-CRCW020140K2FNEDCT-ND; Manufacturer Part Number: CRCW020140K2FNED; RoHS: Yes; Stock: 24960; Pricing: 1=0,1, 10=0,037, 50=0,0242, 100=0,0204, 500=0,01426, 1000=0,01241, 5000=0,00924 (USD); Mounting Technology: Surface Mount; Pins: 2; Package Shape: Rectangular; Case/Package: 0201; Terminal Finish: Nickel; Min Operating Temperature: -55°C; Max Operating Temperature: 155°C; JESD-609 Code: e3; Resistor Type: FIXED RESISTOR; Construction: Chip; Package Style: SMTMeter; Packaging: Tape and Reel; Technology: METAL GLAZE/THICK FILM; Termination: Wraparound; Working Voltage: 30V; Reach SVHC Compliant: Yes; RoHS Compliant: Yes; ComponentLink1URL: https://datasheet.ciiva.com:443/pdfs/VipMasterIC/IC/VISH/VISH-S-A0002932828/VISH-S-A0002932828-1.pdf?src-supplier=IHS+Markit; ComponentLink1Description: https://datasheet.ciiva.com:443/pdfs/VipMasterIC/IC/VISH/VISH-S-A0002932828/VISH-S-A0002932828-1.pdf?src-supplier=IHS+Markit; ComponentLink2URL: https://datasheet.ciiva.com/7671/1719906-7671543.pdf?src-supplier=Element14; ComponentLink2Description: https://datasheet.ciiva.com/7671/1719906-7671543.pdf?src-supplier=Element14; ComponentLink3URL: https://datasheet.ciiva.com/7671/1719906-7671544.pdf?src-supplier=Element14; ComponentLink3Description: https://datasheet.ciiva.com/7671/1719906-7671544.pdf?src-supplier=Element14; ComponentLink4URL: https://datasheet.ciiva.com/2577/crcw0201e3-2577288.pdf?src-supplier=Digikey; ComponentLink4Description: https://datasheet.ciiva.com/2577/crcw0201e3-2577288.pdf?src-supplier=Digikey; ComponentLink5URL: https://datasheet.ciiva.com/6000/1719906-6000661.pdf?src-supplier=Farnell; ComponentLink5Description: https://datasheet.ciiva.com/6000/1719906-6000661.pdf?src-supplier=Farnell; ComponentLink6URL: https://datasheet.ciiva.com/22705/1719906-22705803.pdf?src-supplier=Element14; ComponentLink6Description: https://datasheet.ciiva.com/22705/1719906-22705803.pdf?src-supplier=Element14; Supplier 1: Digikey; Supplier Part Number 1: 541-CRCW020140K2FNEDCT-ND
SW700 = PTS647SN50SMTR2LFS: Pushbutton, NO-MOM, 12V, 0.05A, SMT; Manufacturer: C&K; Category: Pushbutton; Length (mm): 6.5 ±0.20; Manufacturer Part Number: PTS647SN50SMTR2LFS; Rating: 12V,0.05A; Thickness (mm): 1.55 ±0.15; Width (mm): 4.5; Package Description: SMT; Supplier 1: Digi-Key; Supplier Part Number 1: PTS647SN50SMTR2LFSCT-ND; Status: *; Review: *
TP700-TP714 = Test Point: as TP900-TP910 on sheet 09-IMC; Length (mm): 0.90; Manufacturer: N/A; Manufacturer PN: N/A; Medical Grade MFR: N/A; Medical Grade MFR PN: N/A; Rating: N/A; Thickness (mm): N/A; Value: Test point; Width (mm): 0.90; Category: Test point; Status: *; Review: *
U700 U702 U704 = AP7354D-33FS4-7: LDO Regulator, 3.3V, Shutdown, DFN1010-4; Medical Grade MFR: TBD; Length (mm): 1.00 ±0.05; Medical Grade MFR PN: TBD; PCB Footprint: TBD; Rating: 3.3V; Thickness (mm): 0.39 ±0.01; Value: AP7354D-33FS4-7; Width (mm): 1.00 ±0.05; Category: IC; Package Description: TBD; Supplier 1: Digi-Key; Supplier Part Number 1: AP7354D-33FS4-7DICT-ND; Supplier Link: https://octopart.com/search?q=AP7354D-33FS4-7&filter%5Bfields%5D%5Bbrand.name%5D%5B%5D=Diodes+Inc.4-7; Status: *; Review: *; Manufacturer Part Number: AP7354D-33FS4-7
U701 = LT1615ES5-1#TRPBF: Boost, SEPIC Switching Regulator IC Positive Adjustable 1.23V 1 Output 75mA (Switch) SOT-23-5; Medical Grade MFR: TBD; Rating: 100 mA; Category: IC; Length (mm): 2.80 ±0.20; Medical Grade MFR PN: TBD; Package Description: TBD; PCB Footprint: TBD; Thickness (mm): 1.00; Value: LT1615ES5-1#TRPBF; Width (mm): 2.95 ±0.15; Supplier 1: Digi-Key; Supplier Part Number 1: 505-LT1615ES5-1#TRPBFCT-ND; Status: *; Review: *; Manufacturer Part Number: LT1615ES5-1#TRPBF
U703 = ISL23315TFRUZ-T7A: Digital potentiometer, 256 taps, 100k, I2C, QFN-10; Medical Grade MFR: TBD; Category: IC; Length (mm): 2.10; Medical Grade MFR PN: TBD; Package Description: TBD; PCB Footprint: TBD; Rating: TBD; Thickness (mm): 0.55; Value: ISL23315TFRUZ-T7A; Width (mm): 1.60; Supplier 1: Digi-Key; Supplier Part Number 1: ISL23315TFRUZ-T7ACT-ND; Status: *; Review: *; Manufacturer Part Number: ISL23315TFRUZ-T7A
U705 = TPS3831L30DQNR: Reset Monitor, 2.63V, Active low, X2SON; Medical Grade MFR: TBD; Category: IC; Length (mm): 1.00 ±0.05; Medical Grade MFR PN: TBD; PCB Footprint: TBD; Rating: N/A; Thickness (mm): 0.40; Value: TPS3831L30DQNR; Width (mm): 1.00 ±0.05; Package Description: TBD; Supplier 1: Digi-Key; Supplier Part Number 1: 296-40754-1-ND; Status: *; Review: *; Manufacturer Part Number: TPS3831L30DQNR
U706-U708 = DMC31D5UDJ-7: as U905 on sheet 09-IMC; Manufacturer Part Number: DMC31D5UDJ-7; Category: Transistors; Type: MOSFET array; RoHs: RoHS 2; Package: SOT-963; Supplier 1: Digikey; Supplier Part Number 1: DMC31D5UDJ-7DICT-ND
U709 U710 = MAX40200ANS+T: OR Controller Source Selector Switch P-Channel 1:1 4-WLP (0.73x0.73); Manufacturer: Maxim Integrated; Voltage - Supply: 1.5V ~ 5.5V; Current - Output (Max): 1.2A; Value: MAX40200ANS+T; Manufacturer Part Number: MAX40200ANS+T; Mounting Type: SMD; Supplier 1: Digikey; Supplier Part Number 1: MAX40200ANS+TCT-ND